# Altium schematic sheet GSM Modem Core.SchDoc: Telit GE910QUAD GSM Modem Core
size 292 x 193 mm; SheetNumber: 8; SheetTotal: 44
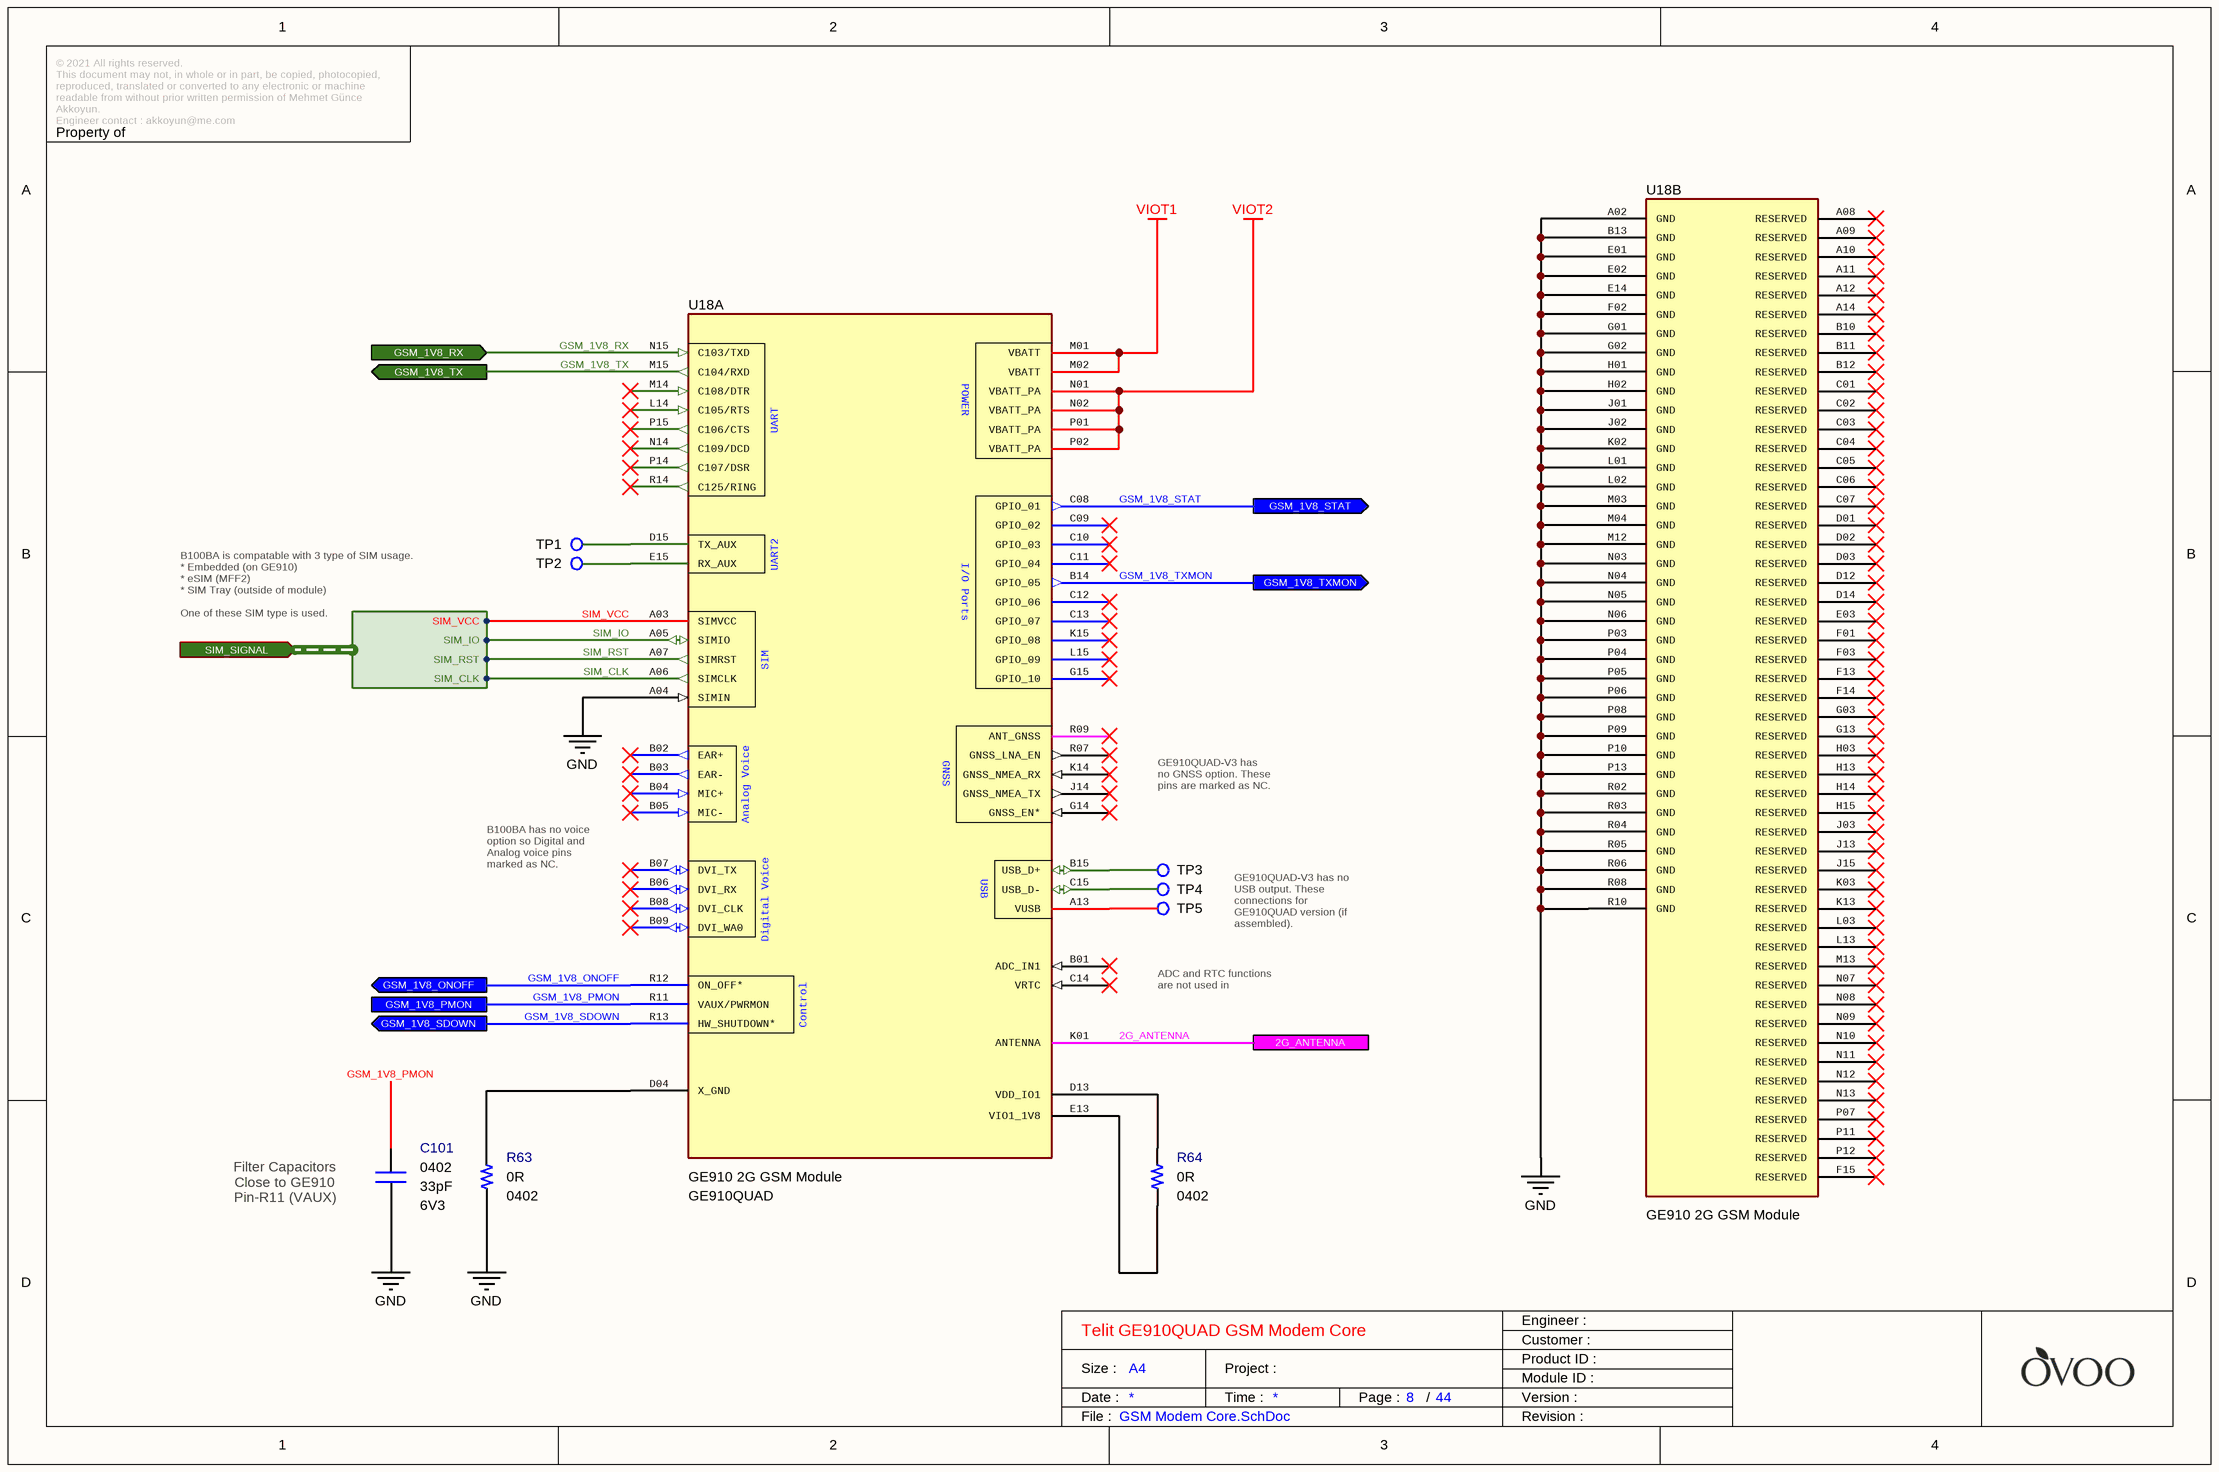
[diagram p0: GSM Modem Core.SchDoc]

## Parts
C101  value 33pF  Case: 0402  Voltage: 6V3  [CAPACITOR_0402]  (hidden comment: Multilayer Ceramic Capacitor)
R63  value 0R  Case: 0402  [RESISTOR_0402]  (hidden comment: Thick Film Resistor)
R64  value 0R  Case: 0402  [RESISTOR_0402]  (hidden comment: Thick Film Resistor)
TP1  PCB - Test Point  [Test_Point]  (value not drawn)  (no BOM)
TP2  PCB - Test Point  [Test_Point]  (value not drawn)  (no BOM)
TP3  PCB - Test Point  [Test_Point]  (value not drawn)  (no BOM)
TP4  PCB - Test Point  [Test_Point]  (value not drawn)  (no BOM)
TP5  PCB - Test Point  [Test_Point]  (value not drawn)  (no BOM)
U18  GE910 2G GSM Module  Manufacturer Part Number: GE910QUAD  [GE910 2G GSM Modem]  (parts A,B of 2)

## Ports
2G_ANTENNA, GSM_1V8_ONOFF (out), GSM_1V8_PMON, GSM_1V8_RX (in), GSM_1V8_SDOWN (out), GSM_1V8_STAT (out), GSM_1V8_TX (out), GSM_1V8_TXMON (out), SIM_SIGNAL (in, harness SIM_SIGNAL)

## Harnesses
SIM_SIGNAL: SIM_VCC, SIM_IO, SIM_RST, SIM_CLK

## Nets
GND: C101.1 R63.1 U18.A02(GND) U18.A04(SIMIN) U18.B13(GND) U18.E01(GND) U18.E02(GND) U18.E14(GND) U18.F02(GND) U18.G01(GND) U18.G02(GND) U18.H01(GND) U18.H02(GND) U18.J01(GND) U18.J02(GND) U18.K02(GND) U18.L01(GND) U18.L02(GND) U18.M03(GND) U18.M04(GND) U18.M12(GND) U18.N03(GND) U18.N04(GND) U18.N05(GND) U18.N06(GND) U18.P03(GND) U18.P04(GND) U18.P05(GND) U18.P06(GND) U18.P08(GND) U18.P09(GND) U18.P10(GND) U18.P13(GND) U18.R02(GND) U18.R03(GND) U18.R04(GND) U18.R05(GND) U18.R06(GND) U18.R08(GND) U18.R10(GND)
VIOT1: U18.M01(VBATT) U18.M02(VBATT)
VIOT2: U18.N01(VBATT_PA) U18.N02(VBATT_PA) U18.P01(VBATT_PA) U18.P02(VBATT_PA)
2G_ANTENNA: U18.K01(ANTENNA) ; port 2G_ANTENNA
GSM_1V8_ONOFF: U18.R12(ON_OFF*) ; port GSM_1V8_ONOFF
GSM_1V8_PMON: C101.2 U18.R11(VAUX/PWRMON) ; port GSM_1V8_PMON
GSM_1V8_RX: U18.N15(C103/TXD) ; port GSM_1V8_RX
GSM_1V8_SDOWN: U18.R13(HW_SHUTDOWN*) ; port GSM_1V8_SDOWN
GSM_1V8_STAT: U18.C08(GPIO_01) ; port GSM_1V8_STAT
GSM_1V8_TX: U18.M15(C104/RXD) ; port GSM_1V8_TX
GSM_1V8_TXMON: U18.B14(GPIO_05) ; port GSM_1V8_TXMON
SIM_CLK: U18.A06(SIMCLK) ; port SIM_SIGNAL.SIM_CLK
SIM_IO: U18.A05(SIMIO) ; port SIM_SIGNAL.SIM_IO
SIM_RST: U18.A07(SIMRST) ; port SIM_SIGNAL.SIM_RST
SIM_VCC: U18.A03(SIMVCC) ; port SIM_SIGNAL.SIM_VCC
NetR63_2: R63.2 U18.D04(X_GND)
NetR64_1: R64.1 U18.E13(VIO1_1V8)
NetR64_2: R64.2 U18.D13(VDD_IO1)
NetTP1_1: TP1.1 U18.D15(TX_AUX)
NetTP2_1: TP2.1 U18.E15(RX_AUX)
NetTP3_1: TP3.1 U18.B15(USB_D+)
NetTP4_1: TP4.1 U18.C15(USB_D-)
NetTP5_1: TP5.1 U18.A13(VUSB)

Not connected (* = marked no-connect by the designer): U18 A08(RESERVED)* A09(RESERVED)* A10(RESERVED)* A11(RESERVED)* A12(RESERVED)* A14(RESERVED)* B01(ADC_IN1)* B02(EAR+)* B03(EAR-)* B04(MIC+)* B05(MIC-)* B06(DVI_RX)* B07(DVI_TX)* B08(DVI_CLK)* B09(DVI_WA0)* B10(RESERVED)* B11(RESERVED)* B12(RESERVED)* C01(RESERVED)* C02(RESERVED)* C03(RESERVED)* C04(RESERVED)* C05(RESERVED)* C06(RESERVED)* C07(RESERVED)* C09(GPIO_02)* C10(GPIO_03)* C11(GPIO_04)* C12(GPIO_06)* C13(GPIO_07)* C14(VRTC)* D01(RESERVED)* D02(RESERVED)* D03(RESERVED)* D12(RESERVED)* D14(RESERVED)* E03(RESERVED)* F01(RESERVED)* F03(RESERVED)* F13(RESERVED)* F14(RESERVED)* F15(RESERVED)* G03(RESERVED)* G13(RESERVED)* G14(GNSS_EN*)* G15(GPIO_10)* H03(RESERVED)* H13(RESERVED)* H14(RESERVED)* H15(RESERVED)* J03(RESERVED)* J13(RESERVED)* J14(GNSS_NMEA_TX)* J15(RESERVED)* K03(RESERVED)* K13(RESERVED)* K14(GNSS_NMEA_RX)* K15(GPIO_08)* L03(RESERVED)* L13(RESERVED)* L14(C105/RTS)* L15(GPIO_09)* M13(RESERVED)* M14(C108/DTR)* N07(RESERVED)* N08(RESERVED)* N09(RESERVED)* N10(RESERVED)* N11(RESERVED)* N12(RESERVED)* N13(RESERVED)* N14(C109/DCD)* P07(RESERVED)* P11(RESERVED)* P12(RESERVED)* P14(C107/DSR)* P15(C106/CTS)* R07(GNSS_LNA_EN)* R09(ANT_GNSS)* R14(C125/RING)*

## Notes on the sheet
- B100BA is compatable with 3 type of SIM usage.
  * Embedded (on GE910)
  * eSIM (MFF2)
  * SIM Tray (outside of module)
  One of these SIM type is used.
- GE910QUAD-V3 has no GNSS option. These pins are marked as NC.
- B100BA has no voice option so Digital and Analog voice pins marked as NC.
- GE910QUAD-V3 has no USB output. These connections for GE910QUAD version (if assembled).
- ADC and RTC functions are not used in B100BA.
- (near C101) Filter Capacitors
  Close to GE910
  Pin-R11 (VAUX)
- © 2021 All rights reserved.
  This document may not, in whole or in part, be copied, photocopied, reproduced, translated or converted to any electronic or machine readable from without prior written permission of Mehmet Günce Akkoyun.
  Engineer contact : akkoyun@me.com
- Property of
- Engineer :
- Date :
- Size :
- A4
- Time :
- Project :
- Page :
- /
- Customer :
- Product ID :
- Module ID :
- Version :
- File :
- Revision :
- (in symbol IC - Telit GE910QUAD, part A) POWER; UART; UART2; I/O Ports; SIM; GNSS; Analog Voice; USB; Digital Voice; Control

## Library data of the parts
C101 = Capacitor - 33pF [0402-6V3]: Capacitor - 33pF [0402] (Ceramic); Manufacturer Name: Kemet; Manufacturer Part Number: C0402C330J9RACAUTO; Dielectric: X7R; Tolerance: 10%; Height: 0.5mm; Maximum Operating Temperature: +125; Minimum Operating Temperature: -55; ROHS: Yes; ComponentLink1Description: DataSheet; ComponentLink1URL: https://api.kemet.com/component-edge/download/datasheet/C0402C330J9RACAUTO.pdf; ComponentLink2Description: Mouser; ComponentLink2URL: https://www.mouser.com/Search/Refine.aspx?Keyword=80-C0402C330J9RAUTO; Supplier 1: Mouser; Supplier Part Number 1: 80-C0402C330J9RAUTO; Mouser Part Number: 80-C0402C330J9RAUTO
R63 R64 = Resistor - 0R: Thick Film Resistors - SMD 1/16 W 0 Ohms; Manufacturer Name: Vishay; Manufacturer Part Number: CRCW04020000Z0ED; Height: 0.4mm; ComponentLink1Description: DataSheet; ComponentLink1URL: https://www.mouser.com.tr/datasheet/2/427/dcrcwe3-1762152.pdf; ComponentLink2Description: Mouser; ComponentLink2URL: https://www.mouser.com.tr/ProductDetail/Vishay-Dale/CRCW04020000Z0ED?qs=sGAEpiMZZMu61qfTUdNhG2DpbjADlD3GG34cJb50zyg%3D; Supplier 1: Mouser; Supplier 2: Digi-Key; Supplier Part Number 1: 71-CRCW0402-0-E3; Supplier Part Number 2: 541-0.0JCT-ND; Mouser Part Number: 71-CRCW0402-0-E3
TP1-TP5 = PCB - Test Point: Test Point
U18 = IC - Telit GE910QUAD: Telit GE910 GPRS/UMTS Module; ComponentLink1Description: Product Page; ComponentLink1URL: https://www.telit.com/product-series/ge910/; Manufacturer Name: Telit; Case: BGA